# EAGLE design step_down_mc34063 (EAGLE 5.06)
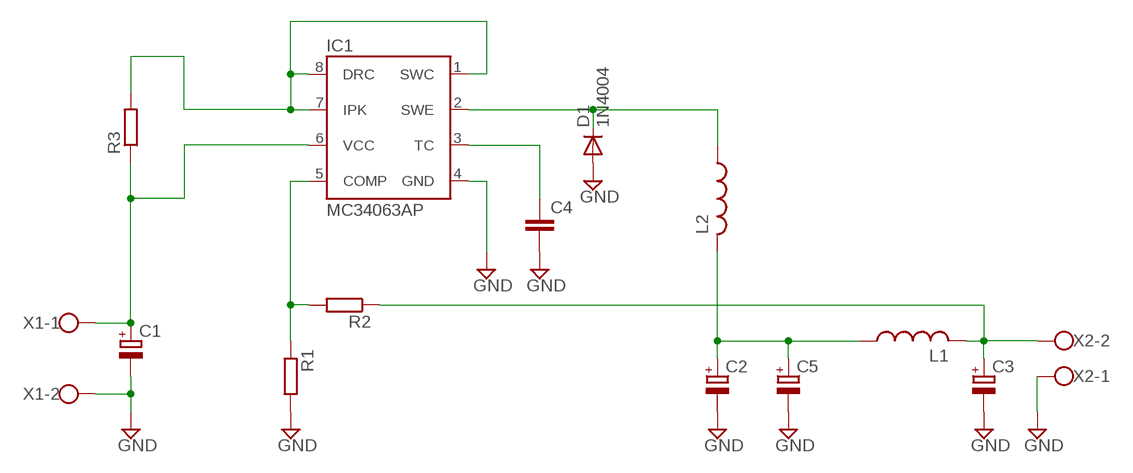
[diagram p0: schematic, sheet 1]

## Parts
C1  CPOL-EUE2.5-7  [E2,5-7]
C2  CPOL-EUE5-10.5  [E5-10,5]
C3  CPOL-EUE2.5-7  [E2,5-7]
C4  C-EU025-024X044  [C025-024X044]
C5  CPOL-EUE2.5-7  [E2,5-7]
D1  1N4004  [DO41-10]
IC1  MC34063AP  [DIL-08]
L1  L-US0207/12  [0207/12]
L2  L-USTJ3-U1  [TJ3-U1]
R1  R-EU_0207/12  [0207/12]
R2  R-EU_0207/12  [0207/12]
R3  R-EU_0617/17  [0617/17]
X1  W237-02P  [W237-132]
X2  W237-02P  [W237-132]

## Nets
GND: C1.- C2.- C3.- C4.2 C5.- D1.A IC1.4(GND) R1.2 X1.2 X2.1
L_IN: D1.C IC1.2(SWE) L2.1
L_OUT: C2.+ C5.+ L1.1 L2.2
N$1: IC1.5(COMP) R1.1 R2.2
N$2: IC1.1(SWC) IC1.7(IPK) IC1.8(DRC) R3.2
N$7: C4.1 IC1.3(TC)
VIN: C1.+ IC1.6(VCC) R3.1 X1.1
VOUT: C3.+ L1.2 R2.1 X2.2

## Library data of the parts
C1-C3 C5 = rcl:CPOL-EU: POLARIZED CAPACITOR, European symbol
C4 = rcl:C-EU: CAPACITOR, European symbol
D1 = diode:1N4004: DIODE general purpose rectifier, 1 A
IC1 = my-v-reg-3:MC34063A: 1.5A Step-Up/Down/Inverting Switching Regulator NPN Darlington Switch, Vin 3V to 40V, Current Limiter Input, adjustable Frequency up to 100kHz
L1 L2 = rcl:L-US: INDUCTOR, American symbol
R1-R3 = rcl:R-EU_: RESISTOR, European symbol
X1 X2 = con-wago-508:W237-02P: WAGO SREW CLAMP

## Board
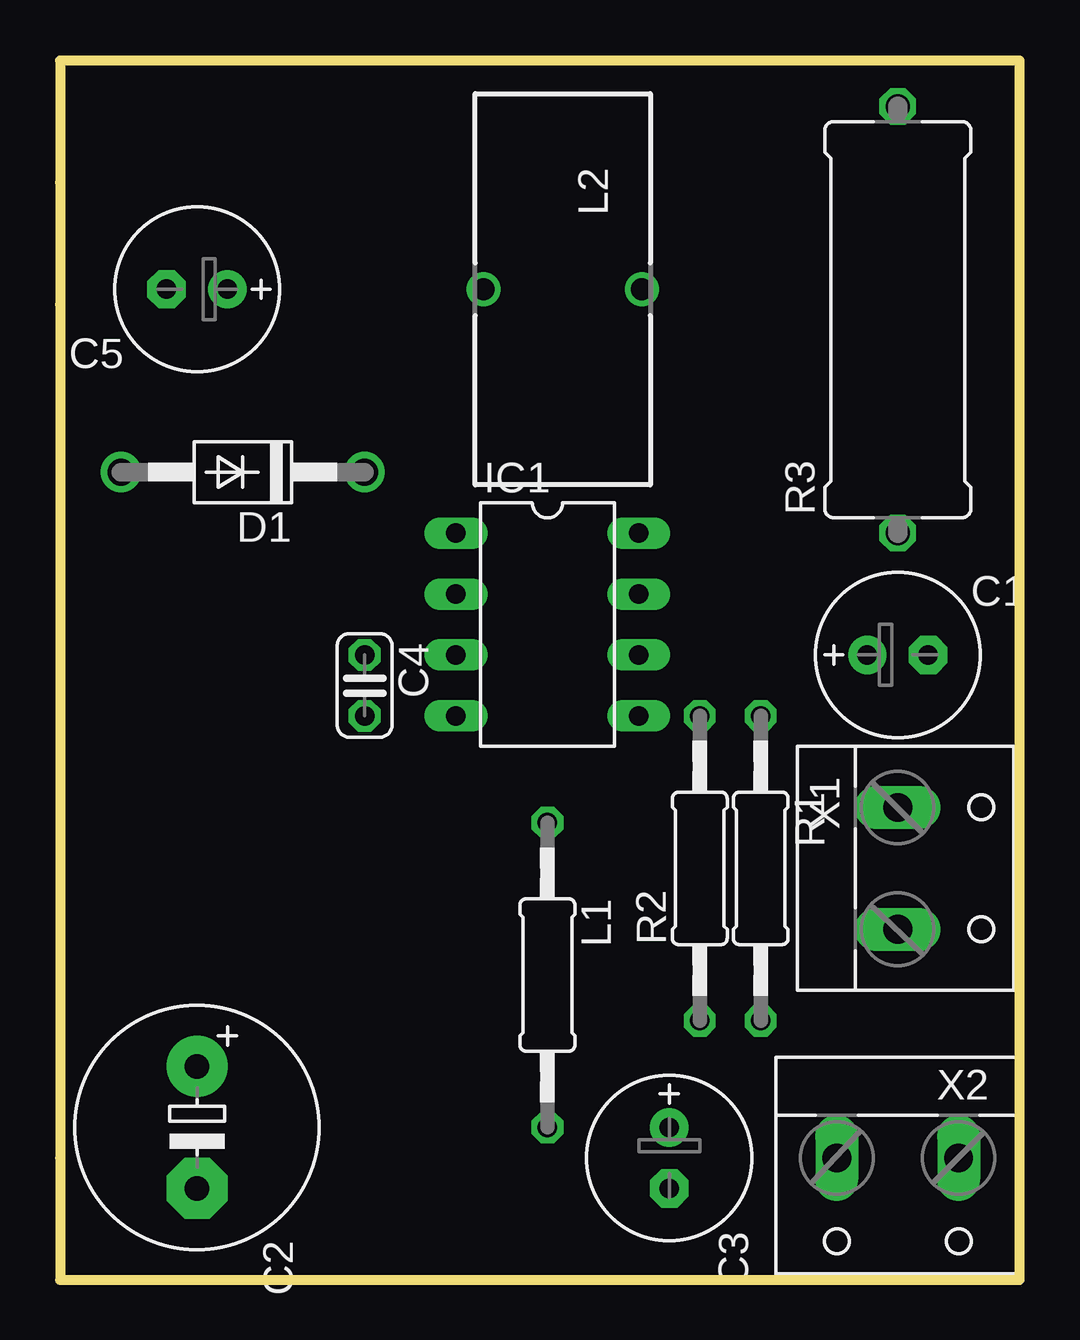
[diagram p1: board, top side]
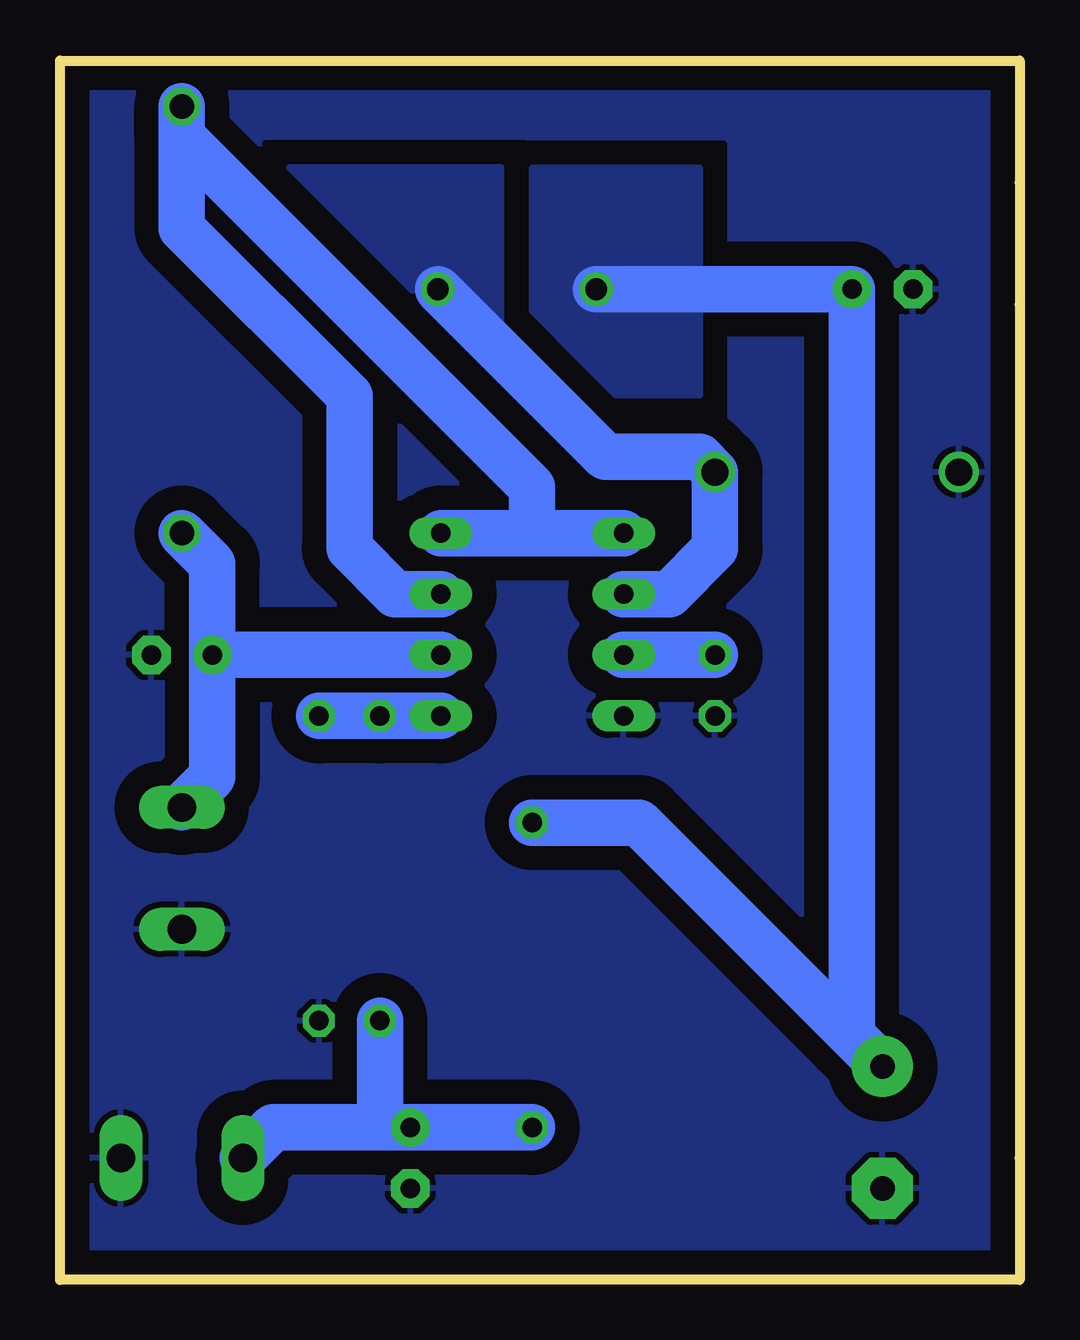
[diagram p2: board, bottom side, seen from below]

Size 40.01 x 50.8 mm. Coordinates in mm from the lower left corner, seen from the top.
Outline: 0,0 40.01,0 40.01,50.8 0,50.8 0,45.72 0,40.64 0,5.08 0,0
Copper layers (1*16): Top 0.035mm / dielectric 1.5mm / Bottom 0.035mm
Design rules "default": minimum track width 10mil, minimum drill 24mil, track to track 8mil, track to pad 8mil, pad to pad 8mil, via to via 8mil, smd to smd 8mil, copper to edge 40mil, drill to drill 8mil, minimum pad ring 10mil, minimum via ring 8mil, stop-mask expansion 4mil, vias tented up to drill 0mil, thermal gap 10mil

### Footprints (pad centres in the part's own frame; a part is rotated, then mirrored left to right if it is on the bottom)
E2,5-7 = drill 0.813 pad 1.6 round: + -1.27,0 | drill 0.813 pad 1.6 octagon: - 1.27,0
E5-10,5 = drill 1.016 pad 2.54 round: + -2.54,0 | drill 1.016 pad 2.54 octagon: - 2.54,0
C025-024X044 = drill 0.813 octagon: 1 -1.27,0; 2 1.27,0
DO41-10 = drill 1.118 round: A 5.08,0; C -5.08,0
DIL-08 = drill 0.813 long: 1 -3.81,-3.81; 2 -1.27,-3.81; 3 1.27,-3.81; 4 3.81,-3.81; 5 3.81,3.81; 6 1.27,3.81; 7 -1.27,3.81; 8 -3.81,3.81
0207/12 = drill 0.813 octagon: 1 -6.35,0; 2 6.35,0
TJ3-U1 = drill 0.9 round: 1 -3.3,0; 2 3.3,0
0617/17 = drill 1.016 octagon: 1 -8.89,0; 2 8.89,0
W237-132 = drill 1.194 long: 1 -2.54,-0.635; 2 2.54,-0.635

### Placement (x,y rotation side)
C1  34.92,26.04 0 top
C2  5.71,6.35 270 top
C3  25.4,5.08 270 top
C4  12.7,24.77 270 top
C5  5.71,41.27 180 top
D1  7.62,33.66 180 top
IC1  20.32,27.3 270 top
L1  20.32,12.7 270 top
L2  20.95,41.27 180 top
R1  29.21,17.14 270 top
R2  26.67,17.14 90 top
R3  34.92,40.01 90 top
X1  35.56,17.14 270 top
X2  34.92,4.45 180 top

### Tracks (layer width: path | path; a pad name or v marks a point on that pad's centre or on a via)
GND
  pour Bottom (isolate 1.016, rank 2): 0,50.8 40.01,50.8 40.01,0 0,0
L_IN
  Bottom 1.93: IC1.2 14.61,28.57 12.7,30.48 D1.C 13.34,34.29 17.27,34.29 L2.1
  pour Bottom (isolate 1.016): 21.59,40.01 21.59,46.35 30.48,46.35 24.13,40.01
L_OUT
  Bottom 1.93: L2.2 C5.+ 6.99,10.16 | C2.+ 6.99,10.16 | 6.99,10.16 15.88,19.05 L1.1
  pour Bottom (isolate 1.016): 17.14,36.83 20.32,40.01 20.32,46.35 13.34,46.35 13.34,36.83
N$1
  Bottom 1.93: IC1.5 R2.2 R1.1
N$2
  Bottom 1.93: IC1.1 20.32,31.11 | 20.32,31.11 IC1.8 | 20.32,31.11 20.32,33.02 34.92,47.62 R3.2 34.92,43.81 27.94,36.83 27.94,30.48 26.04,28.57 IC1.7
N$7
  Bottom 1.93: C4.1 IC1.3
VIN
  Bottom 1.93: IC1.6 C1.+ | C1.+ 33.66,29.84 R3.1 | X1.1 33.66,20.95 C1.+
VOUT
  Bottom 1.93: L1.2 C3.+ 26.67,6.35 | 26.67,6.35 31.11,6.35 X2.2 | 26.67,6.35 R2.1